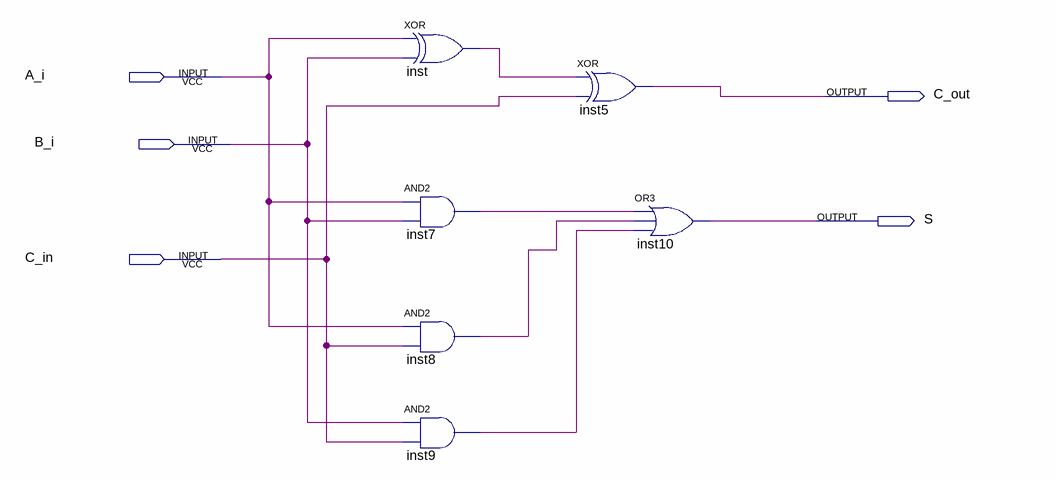
[diagram p0: schematic sheet]
// Quartus schematic 10Prelab_ab.bdf as structural Verilog: 6 symbols, 5 pins
module \10Prelab_ab  (
  input  A_i,
  input  B_i,
  input  C_in,
  output C_out,
  output S
);

  wire inst7_out, inst8_out, inst9_out, inst_out;

  xor inst (inst_out, A_i, B_i);
  and inst7 (inst7_out, A_i, B_i);
  and inst8 (inst8_out, A_i, C_in);
  and inst9 (inst9_out, B_i, C_in);
  xor inst5 (C_out, inst_out, C_in);
  or inst10 (S, inst7_out, inst8_out, inst9_out);
endmodule
